# Altium schematic sheet Master.SchDoc
size A4; SheetNumber: 1; SheetTotal: 1
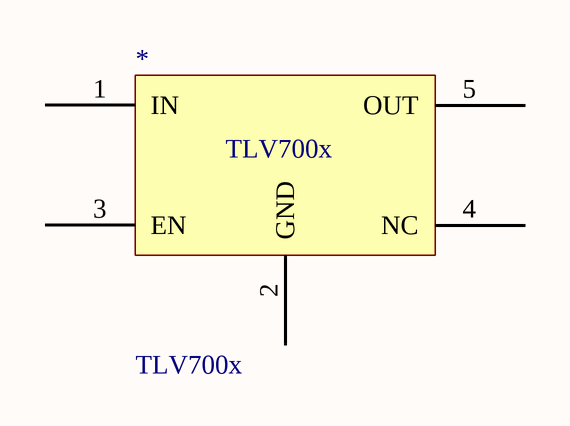
[diagram p0: Master.SchDoc]

## Parts
*  TLV700x  [SOT-23-THIN]

## Nets

Not connected (* = marked no-connect by the designer): * 1(IN) 2(GND) 3(EN) 4(NC) 5(OUT)